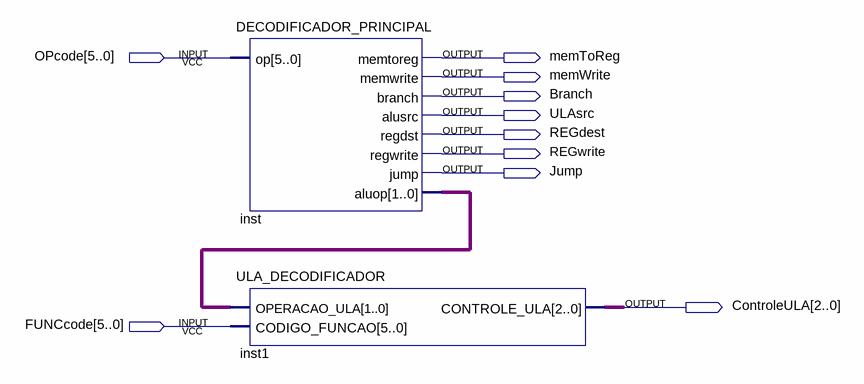
[diagram p0: schematic sheet]
// Quartus schematic UNIDADE_DE_CONTROLE.bdf as structural Verilog: 2 symbols, 10 pins
module UNIDADE_DE_CONTROLE (
  input  [5:0] OPcode,
  input  [5:0] FUNCcode,
  output memToReg,
  output memWrite,
  output Branch,
  output ULAsrc,
  output REGdest,
  output REGwrite,
  output Jump,
  output [2:0] ControleULA
);

  wire [1:0] inst_aluop;

  DECODIFICADOR_PRINCIPAL inst (
    .op(OPcode), .memtoreg(memToReg), .memwrite(memWrite), .branch(Branch), .alusrc(ULAsrc),
    .regdst(REGdest), .regwrite(REGwrite), .jump(Jump), .aluop(inst_aluop));
  ULA_DECODIFICADOR inst1 (.OPERACAO_ULA(inst_aluop), .CODIGO_FUNCAO(FUNCcode), .CONTROLE_ULA(ControleULA));
endmodule
